# Altium schematic sheet ServoDriver.SchDoc
size A; PageSetup: Record=PageOptions|CenterHorizontal=True|CenterVertical=True|PrintScale=1.00|XCorrection=1.00|YCorrection=1.00|PrintKind=1|BorderSize=5000000|LeftOffset=0|BottomOffset=0|Orientation=2|PaperLength=1000|PaperWidth=1000|Scale=100|PaperSource=7|PrintQuality=-4|MediaType=1|DitherType=10|PaperKind=A4|PrintScaleMode=1
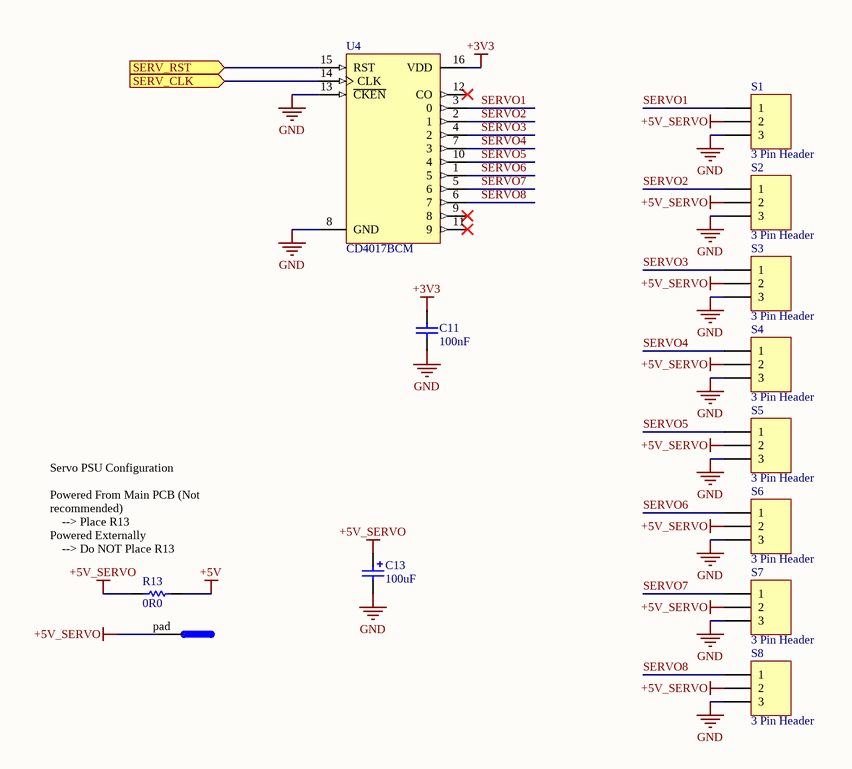
[diagram p0: ServoDriver.SchDoc]

## Parts
C11  100nF  [0603]
C13  value 100uF  [CAP_ELECTRO_6.3x11]  (hidden comment: CP_POL_100uF_25V_6.3mm)
PS  (no value)  [PAD_ROUND]
R13  0R0  [0805]  (no BOM)
S1  3 Pin Header  [G_HDR1X3_RND_PIN1_NO_OVERLAY]
S2  3 Pin Header  [G_HDR1X3_RND_PIN1_NO_OVERLAY]
S3  3 Pin Header  [G_HDR1X3_RND_PIN1_NO_OVERLAY]
S4  3 Pin Header  [G_HDR1X3_RND_PIN1_NO_OVERLAY]
S5  3 Pin Header  [G_HDR1X3_RND_PIN1_NO_OVERLAY]
S6  3 Pin Header  [G_HDR1X3_RND_PIN1_NO_OVERLAY]
S7  3 Pin Header  [G_HDR1X3_RND_PIN1_NO_OVERLAY]
S8  3 Pin Header  [G_HDR1X3_RND_PIN1_NO_OVERLAY]
U4  CD4017BCM  [PW016]

## Ports
SERV_CLK (in), SERV_RST (in)

## Nets
+3V3: C11.2 U4.16(VDD)
+5V: R13.1
+5V_SERVO: C13.1 PS.pad R13.2 S1.2 S2.2 S3.2 S4.2 S5.2 S6.2 S7.2 S8.2
GND: C11.1 C13.2 S1.3 S2.3 S3.3 S4.3 S5.3 S6.3 S7.3 S8.3 U4.8(GND) U4.13(~{CKEN})
SERV_CLK: U4.14(CLK) ; port SERV_CLK
SERV_RST: U4.15(RST) ; port SERV_RST
SERVO1: S1.1 U4.3(0)
SERVO2: S2.1 U4.2(1)
SERVO3: S3.1 U4.4(2)
SERVO4: S4.1 U4.7(3)
SERVO5: S5.1 U4.10(4)
SERVO6: S6.1 U4.1(5)
SERVO7: S7.1 U4.5(6)
SERVO8: S8.1 U4.6(7)

Not connected (* = marked no-connect by the designer): U4 9(8)* 11(9)* 12(CO)*

## Notes on the sheet
- (near R13) Servo PSU Configuration
  Powered From Main PCB (Not recommended)
  --> Place R13
  Powered Externally
  --> Do NOT Place R13

## Library data of the parts
C11 = CP_100nF 0603: CAP CER .10UF 50V X5R 0603; Manufacturer: Taiyo Yuden; Manufacturer PN: UMK107B7104KA-T; Prototype: Digikey 587-1243-1-ND; LatestRevisionDate: 29 May 08; Value: 100nF
C13 = CP_POL_100uF_25V_6.3mm: Polarized Capacitor (Radial); Manufacturer: Multicomp; Manufacturer PN: MCGPR25V107M6.3X11-RH; Prototype: Digikey P833-ND; LatestRevisionDate: 7 Janurary 09
PS = JP_pad: Pad; pin to pad: pad>1
R13 = RS_0R0 0603: RES 0.0 OHM 1/10W 5% 1206 SMD; Manufacturer: Rohm; Manufacturer PN: MCR03EZPJ000; Prototype: DigiKey P0.0ECT-ND; LatestRevisionDate: 3 Jun 08; Value: 0R0
S1-S8 = JP_3PIN HDR: CONN HDR VERT 3POS .100" SNGL; LatestRevisionDate: 24 Jun 08; Value: 3 Pin Header
U4 = CD4017BCM: Decade Counter/Divider with 10 Decoded Outputs; Published: 17-Jul-2002; LatestRevisionDate: 13-Apr-2006; LatestRevisionNote: IPC-7351 Footprint Added.; DatasheetVersion: Jan-1999; PackageVersion: 2000; PackageReference: M16A; Publisher: Altium Limited; PackageDescription: 16-Pin Small Outline Integrated Circuit 1.27 mm Pitch; Code_IPC: SOIC127P600-16; ComponentLink1Description: Manufacturer Link; ComponentLink1URL: http://www.fairchildsemi.com/; ComponentLink2Description: Datasheet; ComponentLink2URL: http://www.fairchildsemi.com/ds/CD%2FCD4017BC.pdf